# Altium project WirelessEarBuds.PrjPcb
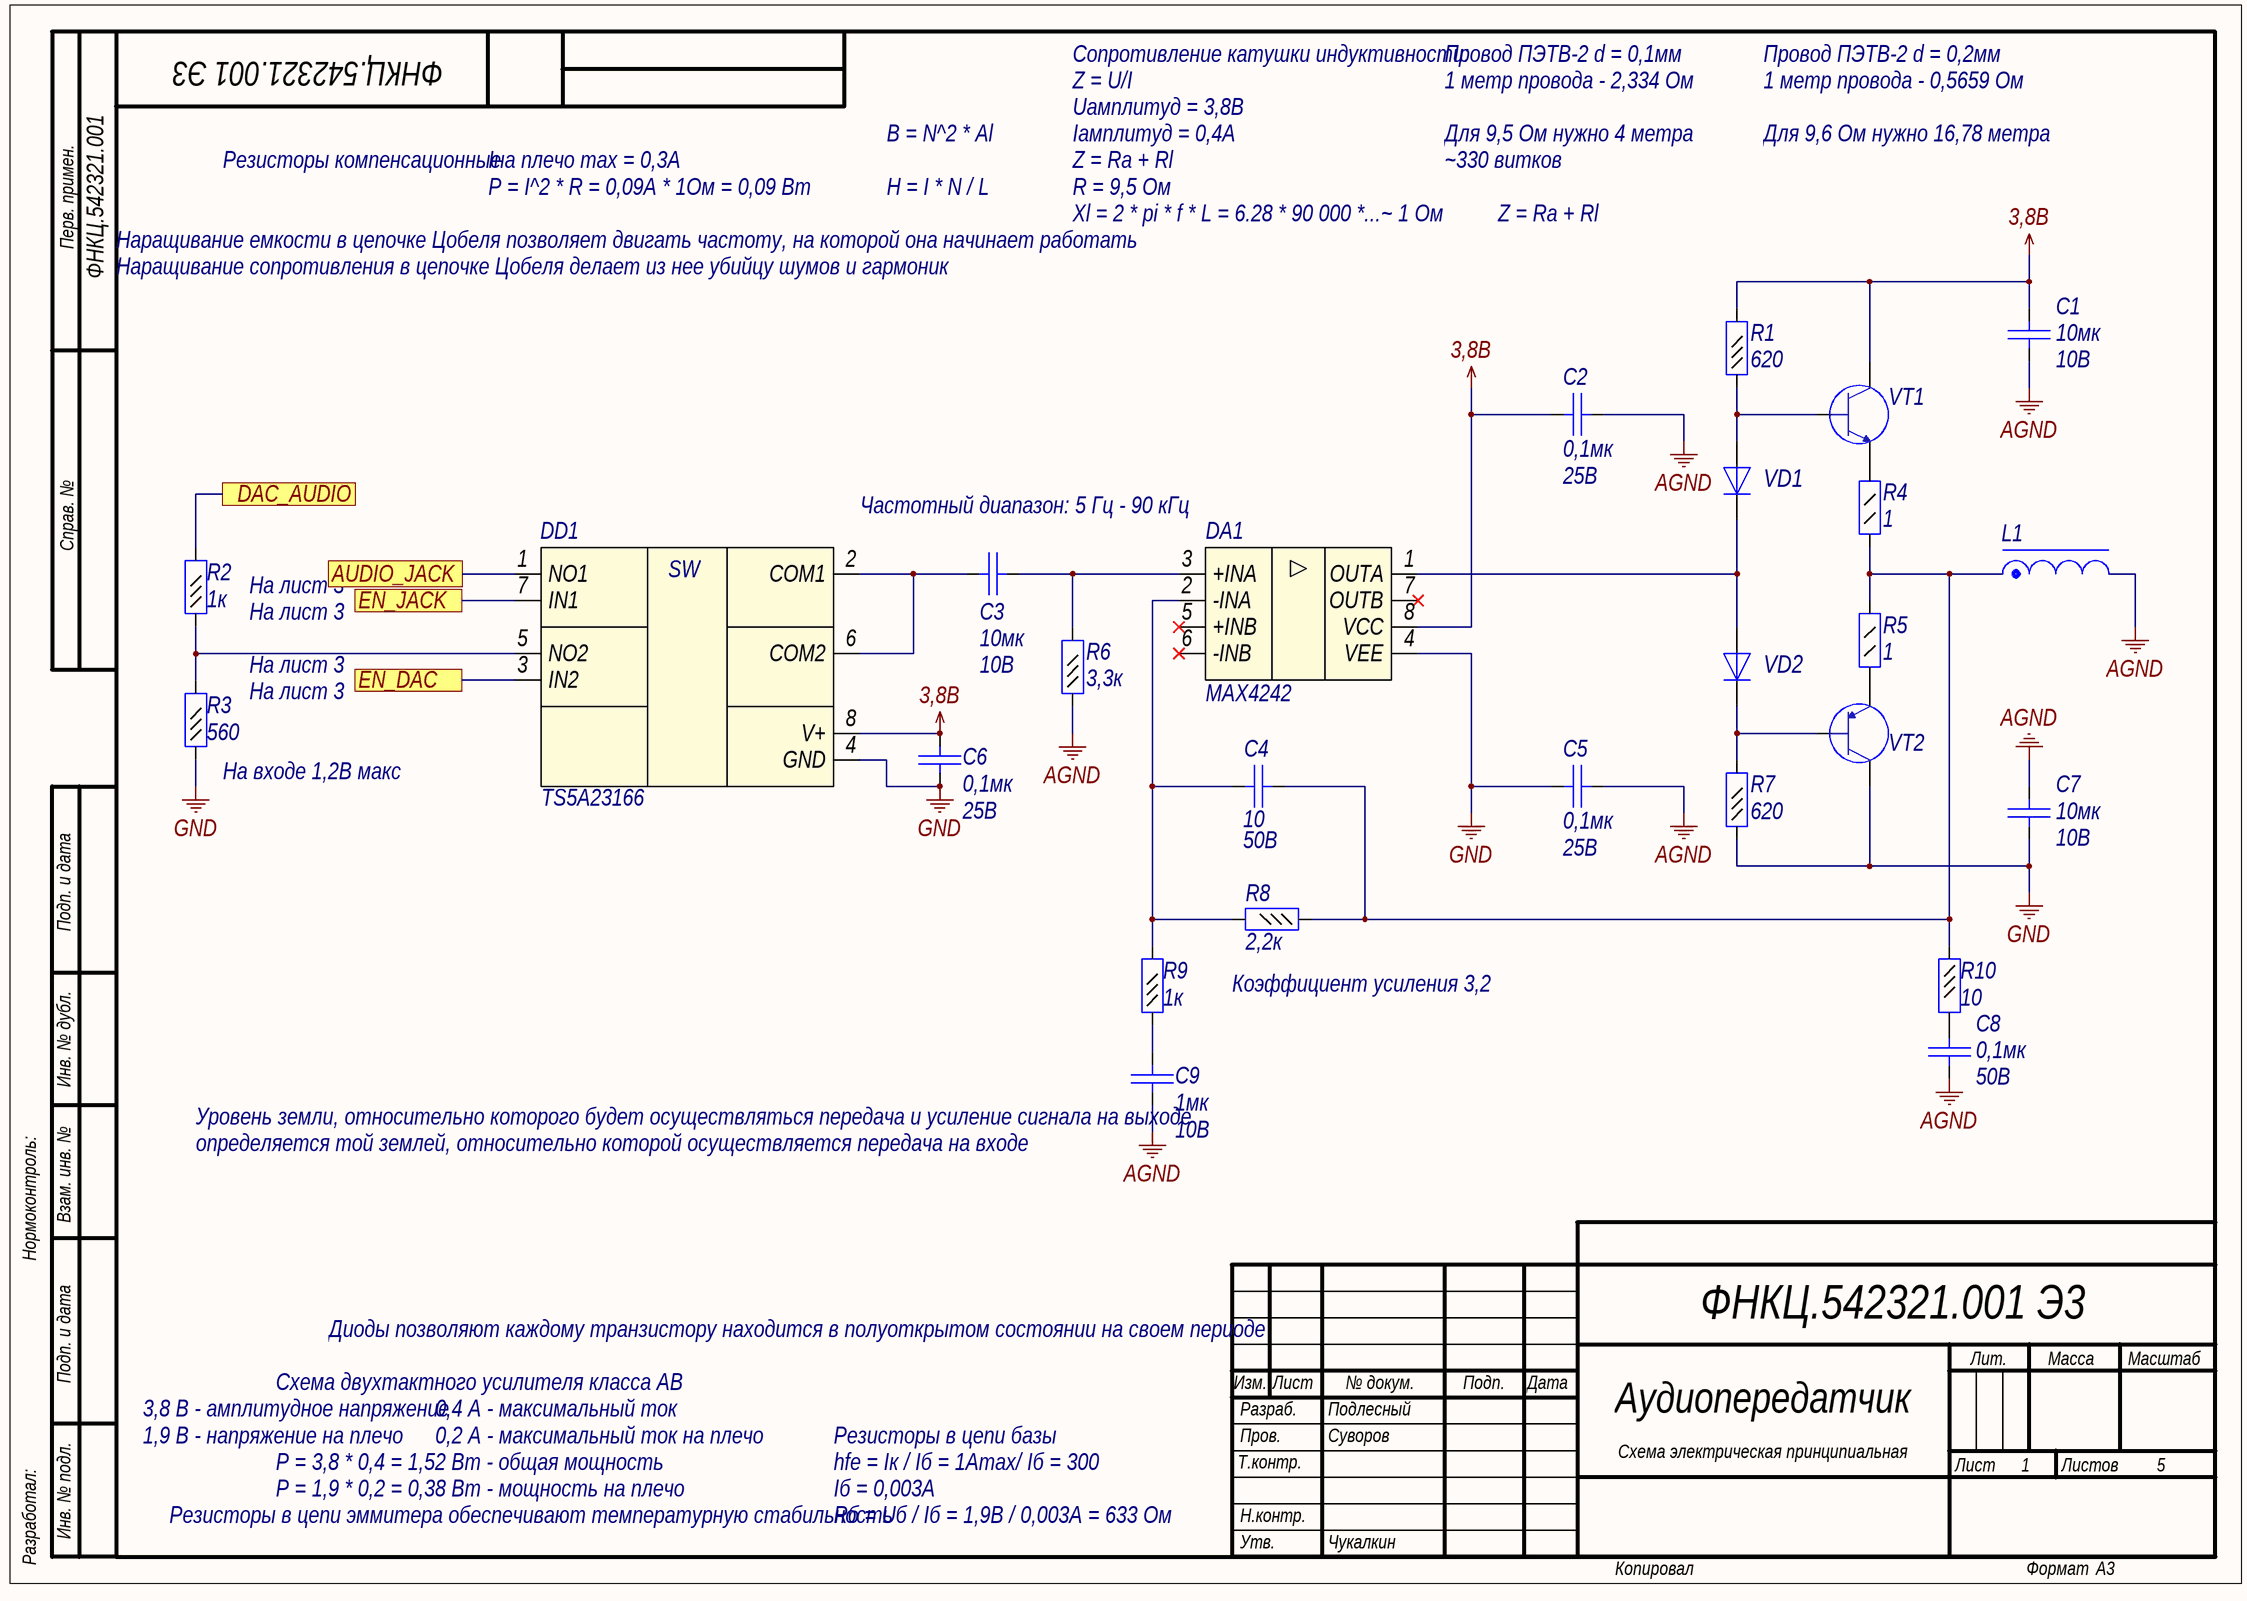
[diagram p0: WirelessEarBuds_Amp.SchDoc]
2 sheets, 46 parts. Net scope: flat (ports and power ports of the same name join across sheets).
Board file: WirelessEarBuds.PcbDoc
Sheets:
  WirelessEarBuds_Amp.SchDoc
  WirelessEarBuds_PhotoHall.SchDoc

## Sheet WirelessEarBuds_Amp.SchDoc: Аудиопередатчик
size 420 x 297 mm; ApprovedBy: Чукалкин; CheckedBy: Суворов; DrawnBy: Подлесный; DocumentNumber: ФНКЦ.542321.001 Э3; SheetNumber: 1; SheetTotal: 5; DocumentType: Схема электрическая принципиальная; Format: A3; ImagePath: ФНКЦ.542321.001

### Parts
C1  value 10мк  Voltage: 10В  [C0805]  (hidden comment: Capacitor)
C2  value 0,1мк  Voltage: 25B  [C0402]  (hidden comment: Capacitor)
C3  value 10мк  Voltage: 10В  [C0805]  (hidden comment: Capacitor)
C4  value 10  Voltage: 50B  [C0402]  (hidden comment: Capacitor)
C5  value 0,1мк  Voltage: 25B  [C0402]  (hidden comment: Capacitor)
C6  value 0,1мк  Voltage: 25B  [C0402]  (hidden comment: Capacitor)
C7  value 10мк  Voltage: 10В  [C0805]  (hidden comment: Capacitor)
C8  value 0,1мк  Voltage: 50B  [C0402]  (hidden comment: Capacitor)
C9  value 1мк  Voltage: 10B  [C0402]  (hidden comment: Capacitor)
DA1  MAX4242  [8µMAX]
DD1  TS5A23166  [US8]
L1  InductorSerd  [InductorPetlya]  (value not drawn)
R1  value 620  [R0402]  (hidden comment: Resistor_0,062Вт)
R2  value 1к  [R0402]  (hidden comment: Resistor_0,062Вт)
R3  value 560  [R0402]  (hidden comment: Resistor_0,062Вт)
R4  value 1  [R0805]  (hidden comment: Resistor_0,125Вт)
R5  value 1  [R0805]  (hidden comment: Resistor_0,125Вт)
R6  value 3,3к  [R0402]  (hidden comment: Resistor_0,062Вт)
R7  value 620  [R0402]  (hidden comment: Resistor_0,062Вт)
R8  value 2,2к  [R0402]  (hidden comment: Resistor_0,062Вт)
R9  value 1к  [R0402]  (hidden comment: Resistor_0,062Вт)
R10  value 10  [R0402]  (hidden comment: Resistor_0,062Вт)
VD1  Diode  [SOD-323]  (value not drawn)
VD2  Diode  [SOD-323]  (value not drawn)
VT1  BJT NPN  [SOT-223]  (value not drawn)
VT2  BJT PNP  [SOT-223]  (value not drawn)

### Ports
AUDIO_JACK, DAC_AUDIO, EN_DAC, EN_JACK

### Nets
3,8B: C1.2 C2.2 C6.1 DA1.8(VCC) DD1.8(V+) R1.2 VT1.2
AGND: C1.1 C2.1 C5.1 C7.2 C8.1 C9.1 L1.2 R6.1
GND: C5.2 C6.2 C7.1 DA1.4(VEE) DD1.4(GND) R3.1 R7.1 VT2.2
NetC3_1: C3.1 DD1.2(COM1) DD1.6(COM2)
NetC3_2: C3.2 DA1.3(+INA) R6.2
NetC4_1: C4.1 DA1.2(-INA) R8.2 R9.2
NetC4_2: C4.2 L1.1 R4.1 R5.2 R8.1 R10.1
NetC8_2: C8.2 R10.2
NetC9_2: C9.2 R9.1
NetDA1_1: DA1.1(OUTA) VD1.1(K) VD2.2(A)
NetDD1_1: DD1.1(NO1) ; port AUDIO_JACK
NetDD1_3: DD1.3(IN2) ; port EN_DAC
NetDD1_5: DD1.5(NO2) R2.1 R3.2
NetDD1_7: DD1.7(IN1) ; port EN_JACK
NetR1_1: R1.1 VD1.2(A) VT1.1
NetR2_2: R2.2 ; port DAC_AUDIO
NetR4_2: R4.2 VT1.3
NetR5_1: R5.1 VT2.3
NetR7_2: R7.2 VD2.1(K) VT2.1

Not connected (* = marked no-connect by the designer): DA1 5(+INB)* 6(-INB)* 7(OUTB)*

### Notes on the sheet
- Сопротивление катушки индуктивности:
- Z = U/I
- Uамплитуд = 3,8B
- Провод ПЭТВ-2 d = 0,1мм
- 1 метр провода - 2,334 Ом
- Провод ПЭТВ-2 d = 0,2мм
- 1 метр провода - 0,5659 Ом
- Перв. примен.
- Резисторы компенсационные
- Iна плечо max = 0,3A
- B = N^2 * Al
- Iамплитуд = 0,4A
- Z = Ra + Rl
- Для 9,5 Ом нужно 4 метра
- ~330 витков
- Для 9,6 Ом нужно 16,78 метра
- Наращивание емкости в цепочке Цобеля позволяет двигать частоту, на которой она начинает работать
- P = I^2 * R = 0,09A * 1Ом = 0,09 Вт
- H = I * N / L
- R = 9,5 Ом
- Xl = 2 * pi * f * L = 6.28 * 90 000 *...~ 1 Ом
- Наращивание сопротивления в цепочке Цобеля делает из нее убийцу шумов и гармоник
- Справ. №
- Частотный диапазон: 5 Гц - 90 кГц
- (near R2) На лист 3
- (near R3) На лист 3
- На лист 3
- (near R3) На входе 1,2В макс
- Подп. и дата
- Коэффициент усиления 3,2
- Инв. № дубл.
- (near C9) Уровень земли, относительно которого будет осуществляться передача и усиление сигнала на выходе
- Нормоконтроль:
- Взам. инв. №
- (near C9) определяется той землей, относительно которой осуществляется передача на входе
- Диоды позволяют каждому транзистору находится в полуоткрытом состоянии на своем периоде
- Схема двухтактного усилителя класса АВ
- Изм.
- Лист
- № докум.
- Подп.
- Дата
- Лит.
- Масса
- Масштаб
- 3,8 В - амплитудное напряжение
- 1,9 В - напряжение на плечо
- Р = 3,8 * 0,4 = 1,52 Вт - общая мощность
- 0,4 А - максимальный ток
- 0,2 А - максимальный ток на плечо
- Резисторы в цепи базы
- hfe = Iк / Iб = 1Amax/ Iб = 300
- Т.контр.
- Пров.
- Разраб.
- Листов
- Разработал:
- Инв. № подл.
- Резисторы в цепи эммитера обеспечивают температурную стабильность
- Р = 1,9 * 0,2 = 0,38 Вт - мощность на плечо
- Iб = 0,003A
- Rб = Uб / Iб = 1,9В / 0,003A = 633 Ом
- Н.контр.
- Утв.
- Копировал
- Формат
- (in symbol logic11) SW

### Library data of the parts
C1 C3 C7 = cap201: Конденсатор; Part Name: Ceramic; Manufacture: Murata; Part Number: GRM21BR71A106KE51L; id: cap201; TKE: X7R
C2 C5 C6 = cap52: Конденсатор; Part Name: Ceramic; Manufacture: Murata; Part Number: GRM155F51E104Z**; id: cap52; TKE: Y5V
C4 C8 = cap5: Конденсатор; Part Name: Ceramic; Manufacture: Murata; Part Number: GRM1535C1H100J; id: cap5; TKE: NP0
C9 = cap55: Конденсатор; Part Name: Ceramic; Manufacture: Murata; Part Number: GRM155R61A105K; id: cap55; TKE: Y5V
DA1 = amp13: МИКРОМОЩНЫЙ Single/Dual/Quad, +1.8V/10µA, SOT23,  Beyond-the-Rails Op Amps; Part Name: Micropower / Operational Amplifiers; Part Number: MAX4242EUA; Manufacture: Maxim Integrated; id: amp13; Rail-to-rail: yes; Supply Voltage: 1,8В–5,5В or (+-)0,9В-(+-)2,75B; Supply Current max: 10uA; Bandwidth: 90kHz; Input Bias Current: (+-)2,3nA; CMRR: 90dB; PSRR: 85dB; Offset voltage: (+-)0,2mB; Channels: 1
DD1 = logic11: Dual-SPST Analog Switch; Manufacture: Texas Instruments; Type of Logic: CMOS; Number of elements: 2; Logic High Level: 1,5-5,5B; Logic Low Level: 0,6B; Charge Injection: 6pC; Toff: 5ns; Ton: 8,5ns; Resistance of channel: 1,1Ohm; Power Supply: 1,65В-5,5B; id: logic11; Part Name: Dual-SPST Analog Switch; Part Number: TS5A23166
L1 = ind67: EMI Suppression Filter; Part Name: My own inductor for petlya; id: ind67
R1 R7 = res261: Резистор; Manufacture: Yageo; Part Number: RC0402FR-07620RL; id: res261; Accuracy: 1%; Part Name: Resistor; Power: 0,062Вт
R2 R3 R6 R8-R10 = res278: Резистор; Manufacture: Yageo; Part Number: RC0402FR-072K3; id: res278; Accuracy: 1%; Part Name: Resistor; Power: 0,062Вт
R4 R5 = res1: Резистор; Manufacture: Yageo; Part Number: RC0805FR-071RL; id: res1; Accuracy: 1%; Part Name: Resistor; Power: 0,125Вт
VD1 VD2 = diode18: Диод; Part Number: BAS321.115; Manufacture: NXP Semiconductor; Max Reverse Voltage: 250В; Forward Voltage: 1,25В; Forward Current: 0,25А; Breakdown Current: 100nA; Reverse Recovery time: 50ns; Capacitance: 2pF; Number of Channels: 1; id: diode18; Part Name: Diode
VT1 = bjt3: Part Name: Transistor; Part Number: PBSS4540Z.115; Manufacture: NXP Semiconductor; id: bjt3; hfe: 300; Vceo max: 40В; Ic max: 5А; Power: 2Вт; Frequency: 130МГц; Structure: npn
VT2 = bjt4: Part Name: Transistor; Part Number: PBSS5540Z.115; Manufacture: NXP Semiconductor; id: bjt4; hfe: 300; Vceo max: 40В; Ic max: 5А; Power: 2Вт; Frequency: 130МГц; Structure: pnp

## Sheet WirelessEarBuds_PhotoHall.SchDoc
size 420 x 297 mm; DocumentNumber: ФНКЦ.542321.001 Э3; SheetNumber: 4; Format: A3
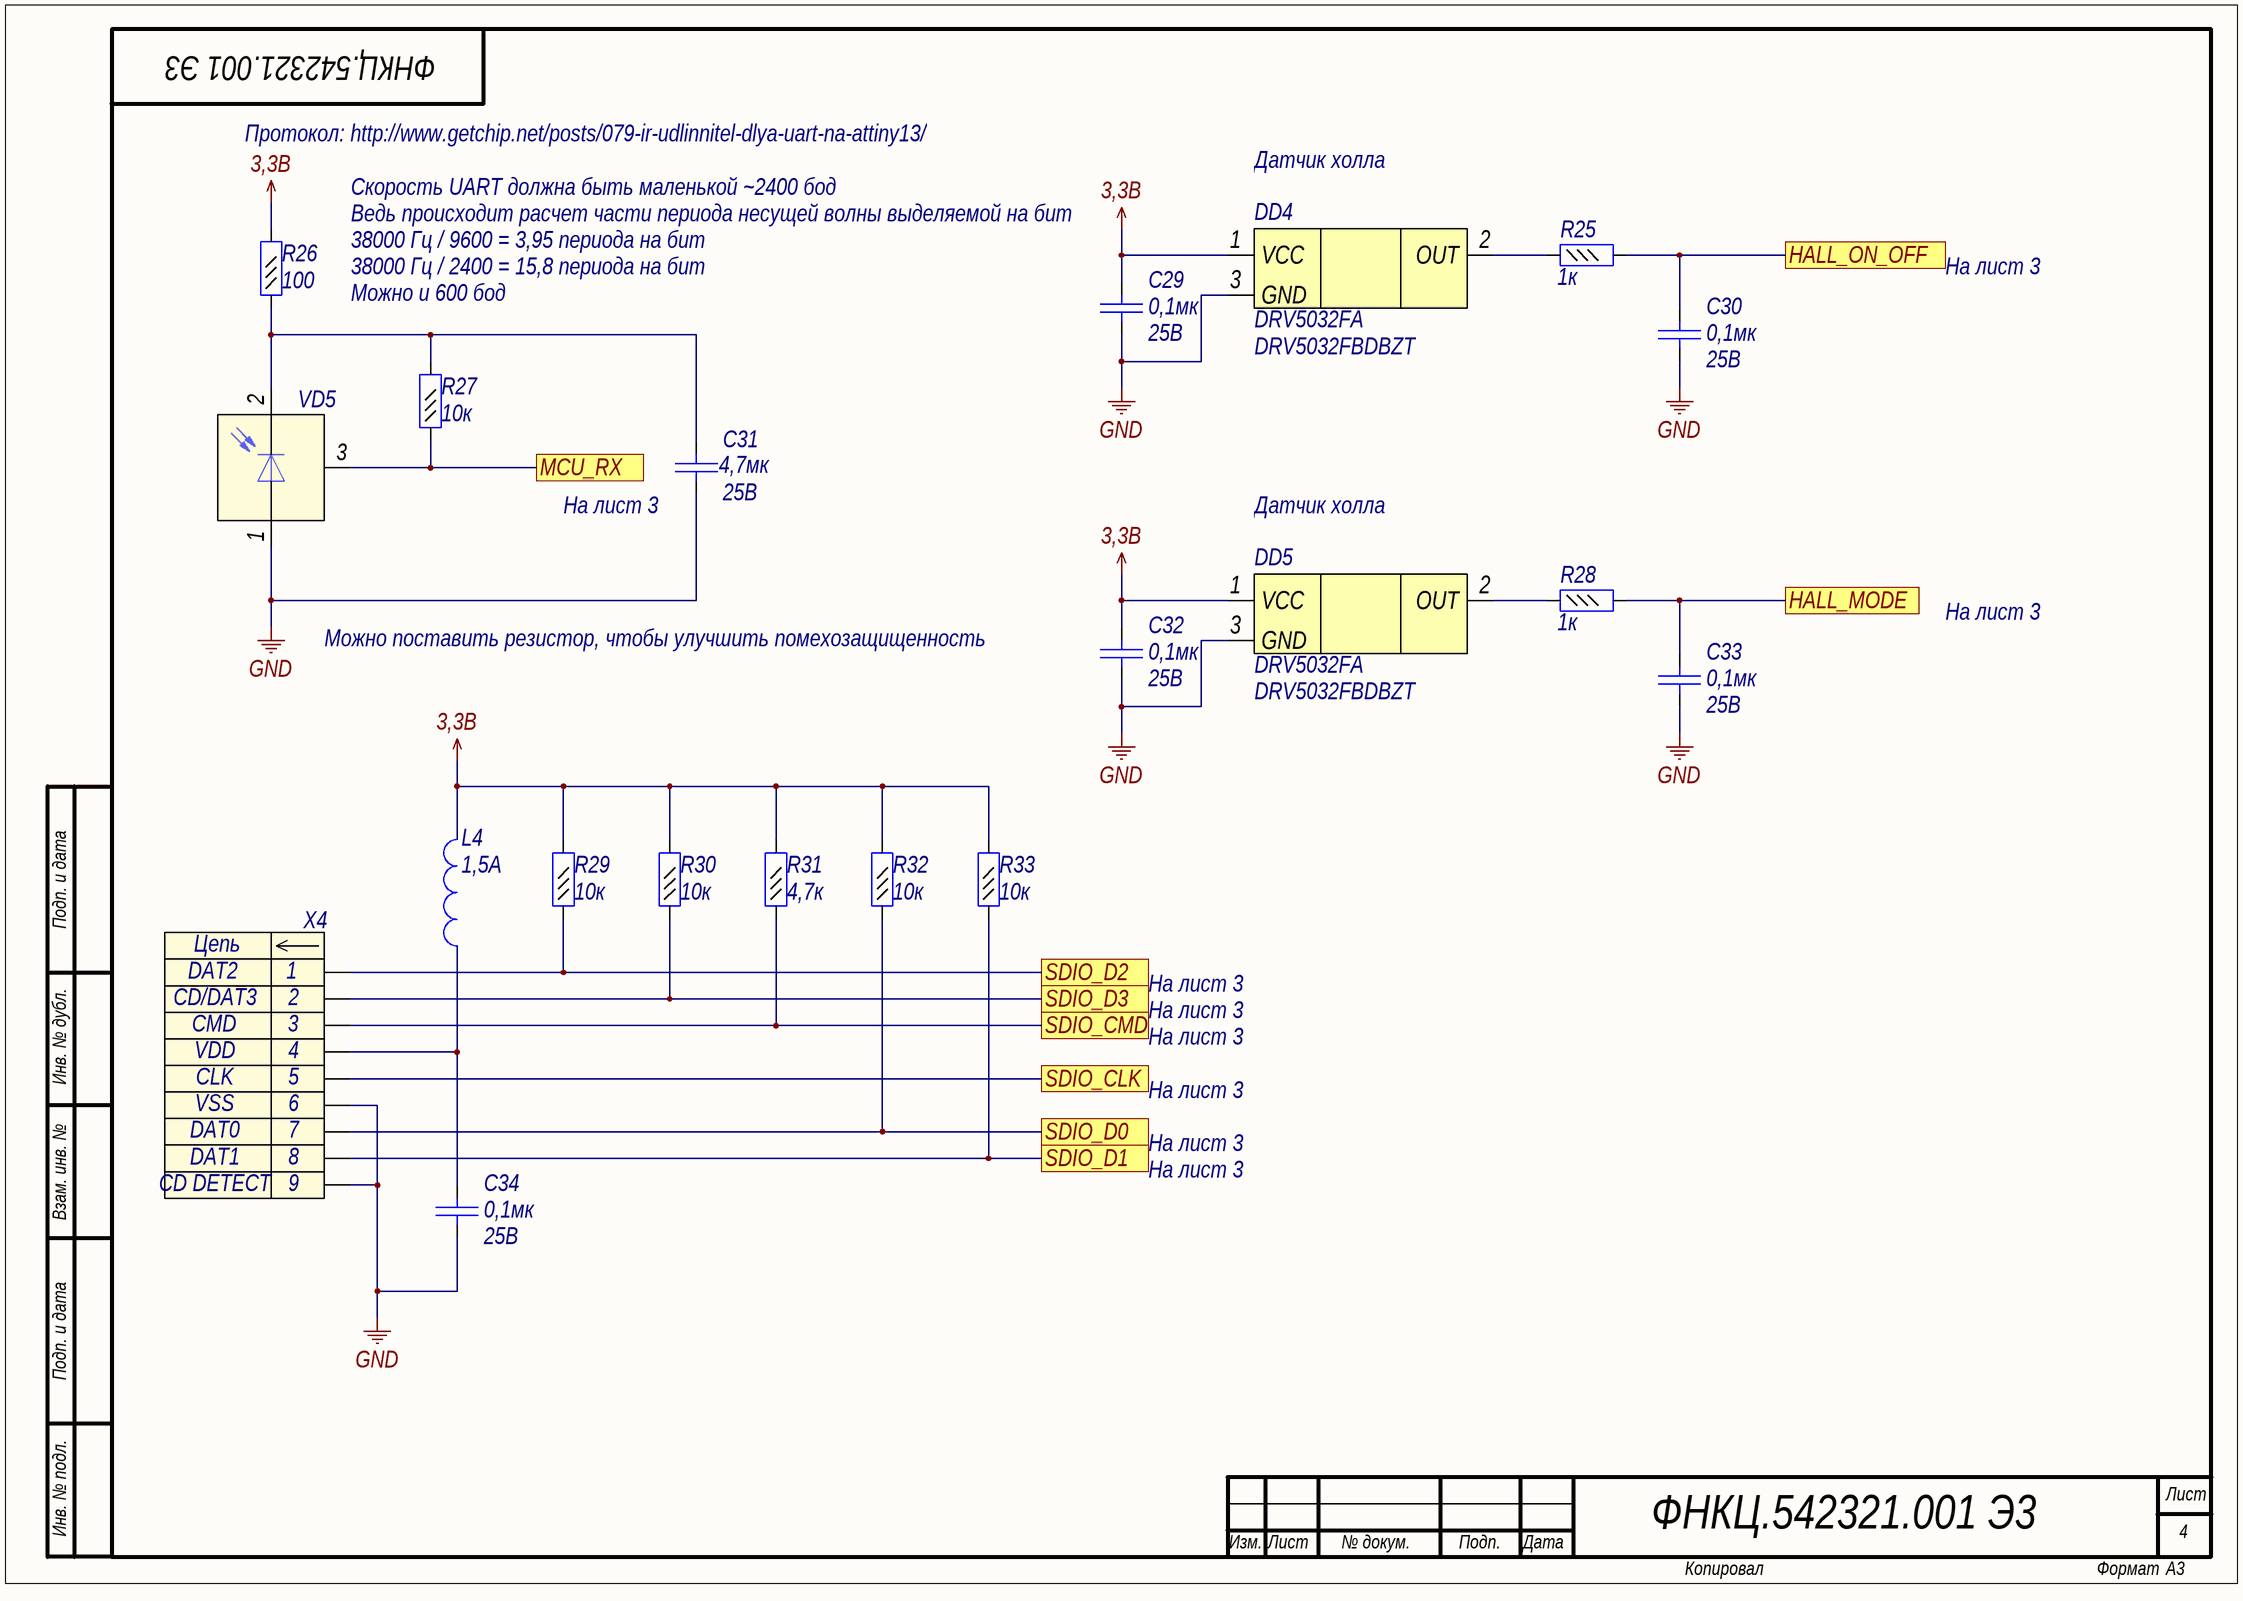
[diagram p1: WirelessEarBuds_PhotoHall.SchDoc]

### Parts
C29  value 0,1мк  Voltage: 25B  [C0402]  (hidden comment: Capacitor)
C30  value 0,1мк  Voltage: 25B  [C0402]  (hidden comment: Capacitor)
C31  value 4,7мк  Voltage: 25B  [C0805]  (hidden comment: Capacitor)
C32  value 0,1мк  Voltage: 25B  [C0402]  (hidden comment: Capacitor)
C33  value 0,1мк  Voltage: 25B  [C0402]  (hidden comment: Capacitor)
C34  value 0,1мк  Voltage: 25B  [C0402]  (hidden comment: Capacitor)
DD4  Part Number: DRV5032FA  [SOT23-3]  (hidden comment: DRV5032)
DD5  Part Number: DRV5032FA  [SOT23-3]  (hidden comment: DRV5032)
L4  Rated Current: 1,5A  [L0603]  (hidden comment: Inductor)
R25  value 1к  [R0402]  (hidden comment: Resistor_0,062Вт)
R26  value 100  [R0402]  (hidden comment: Resistor_0,062Вт)
R27  value 10к  [R0402]  (hidden comment: Resistor_0,062Вт)
R28  value 1к  [R0402]  (hidden comment: Resistor_0,062Вт)
R29  value 10к  [R0402]  (hidden comment: Resistor_0,062Вт)
R30  value 10к  [R0402]  (hidden comment: Resistor_0,062Вт)
R31  value 4,7к  [R0402]  (hidden comment: Resistor_0,062Вт)
R32  value 10к  [R0402]  (hidden comment: Resistor_0,062Вт)
R33  value 10к  [R0402]  (hidden comment: Resistor_0,062Вт)
VD5  IR_LED  [TVCAST]  (value not drawn)
X4  MICROSD-SDIO  [MICROSD]  (value not drawn)

### Ports
HALL_MODE, HALL_ON_OFF, MCU_RX, SDIO_CLK, SDIO_CMD, SDIO_D0, SDIO_D1, SDIO_D2, SDIO_D3

### Nets
3,3B: C29.1 C32.1 DD4.1(VCC) DD5.1(VCC) L4.2 R26.2 R29.2 R30.2 R31.2 R32.2 R33.2
GND: C29.2 C30.2 C31.1 C32.2 C33.2 C34.2 DD4.3(GND) DD5.3(GND) VD5.1(GND) X4.6 X4.9
NetC30_1: C30.1 R25.2 ; port HALL_ON_OFF
NetC31_2: C31.2 R26.1 R27.2 VD5.2(VCC)
NetC33_1: C33.1 R28.2 ; port HALL_MODE
NetC34_1: C34.1 L4.1 X4.4
NetDD4_2: DD4.2(OUT) R25.1
NetDD5_2: DD5.2(OUT) R28.1
NetR27_1: R27.1 VD5.3(OUT) ; port MCU_RX
NetR29_1: R29.1 X4.1 ; port SDIO_D2
NetR30_1: R30.1 X4.2 ; port SDIO_D3
NetR31_1: R31.1 X4.3 ; port SDIO_CMD
NetR32_1: R32.1 X4.7 ; port SDIO_D0
NetR33_1: R33.1 X4.8 ; port SDIO_D1
NetX4_5: X4.5 ; port SDIO_CLK

### Notes on the sheet
- Протокол: http://www.getchip.net/posts/079-ir-udlinnitel-dlya-uart-na-attiny13/
- Датчик холла
- Скорость UART должна быть маленькой ~2400 бод
- Ведь происходит расчет части периода несущей волны выделяемой на бит
- 38000 Гц / 9600 = 3,95 периода на бит
- 38000 Гц / 2400 = 15,8 периода на бит
- Можно и 600 бод
- На лист 3
- (near DD4) DRV5032FBDBZT
- (near C31) На лист 3
- Можно поставить резистор, чтобы улучшить помехозащищенность
- (near DD5) DRV5032FBDBZT
- Подп. и дата
- Инв. № дубл.
- Взам. инв. №
- Инв. № подл.
- Лист
- Изм.
- № докум.
- Подп.
- Дата
- Копировал
- Формат
- (in symbol connect43) Цепь; CD DETECT

### Library data of the parts
C29 C30 C32-C34 = cap52: as C2 on sheet WirelessEarBuds_Amp
C31 = cap154: Конденсатор; Part Name: Ceramic; Manufacture: Murata; Part Number: GRM21BR61E475KA12L; id: cap154; TKE: X5R
DD4 DD5 = DRV5032FA: Датчик Холла с рекордно низким потреблением; Part Name: Hall sensor; Manufacture: Texas Instruments; id: hall1; Magnetic threshold: 4,8mT; MAGNETIC RESPONSE: Omnipolar; OUTPUT TYPE: Push-pull; SAMPLING RATE: 20 Hz; Power Supply: 1,65B...5,5B
L4 = ind0: EMI Suppression Filter; Part Name: EMI Suppression Filters; Part Number: BLM18PG181SN1D; id: ind0; Resistance: 0,09Ohm
R25 R28 = res266: Резистор; Manufacture: Yageo; Part Number: RC0402FR-071KL; id: res266; Accuracy: 1%; Part Name: Resistor; Power: 0,062Вт
R26 = res242: Резистор; Manufacture: Yageo; Part Number: RC0402FR-07100RL; id: res242; Accuracy: 1%; Part Name: Resistor; Power: 0,062Вт
R27 R29 R30 R32 R33 = res290: Резистор; Manufacture: Yageo; Part Number: RC0402FR-0710KL; id: res290; Accuracy: 1%; Part Name: Resistor; Power: 0,062Вт
R31 = res282: Резистор; Manufacture: Yageo; Part Number: RC0402FR-074K7; id: res282; Accuracy: 1%; Part Name: Resistor; Power: 0,062Вт
VD5 = diode26: Светодиод; Part Name: IR Receiver Modules; Part Number: TSOP39238; Manufacture: Vishay; Supply Voltage: 2,5-5,5B; Carrier Frequency: 38kHz; Transmission Distance: 30m; Viewing Angle: (+-)45; Detection Treshold: 0.08; id: diode26
X4 = connect43: Contact_1: DAT2; Contact_2: CD/DAT3; Contact_3: CMD; Contact_4: VDD; Contact_5: CLK; Contact_6: VSS; Contact_7: DAT0; Contact_8: DAT1; Part Name: MICRO SD-SDIO; id: connect43

## Nets that join several sheets
GND: WirelessEarBuds_Amp (8 pins), WirelessEarBuds_PhotoHall (11 pins)